# EAGLE schematic memory-slice (EAGLE 7.1.0)
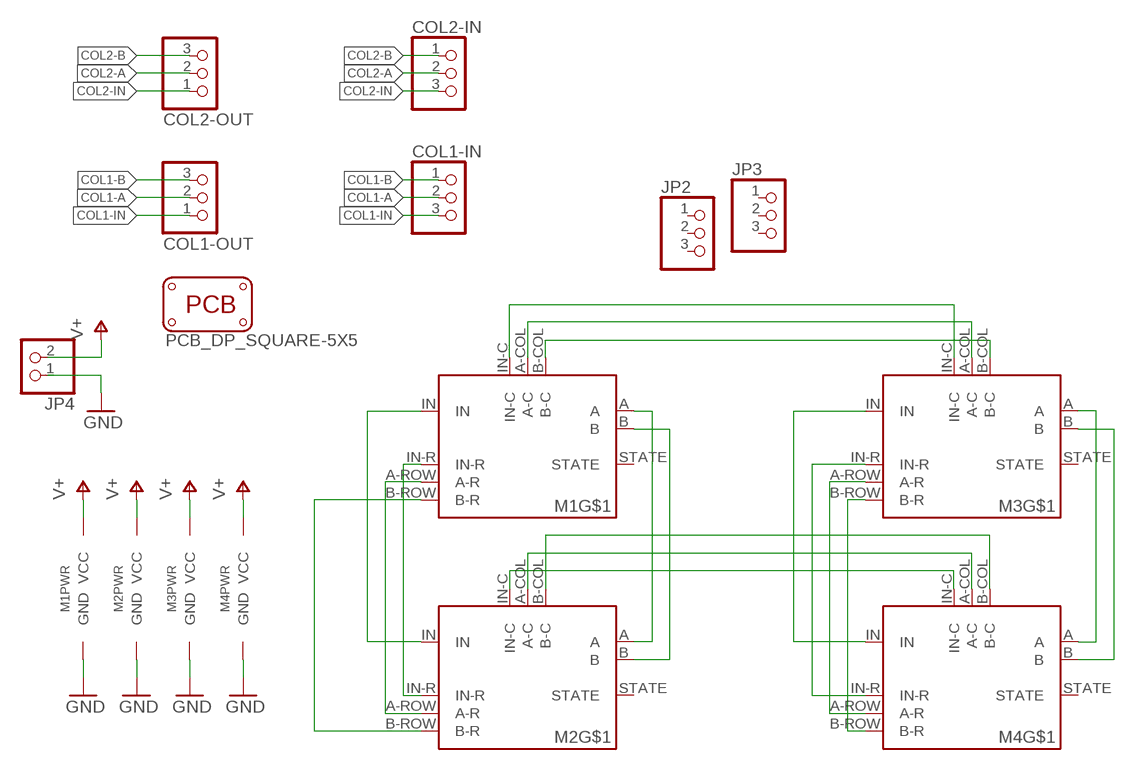
[diagram p0: schematic, sheet 1]

## Parts
COL1-IN  PINHD-1X3/90  [1X03/90]
COL1-OUT  PINHD-1X3/90  [1X03/90]
COL2-IN  PINHD-1X3/90  [1X03/90]
COL2-OUT  PINHD-1X3/90  [1X03/90]
JP2  PINHD-1X3/90  [1X03/90]
JP3  PINHD-1X3/90  [1X03/90]
JP4  PINHD-1X2  [1X02]
M1  MEMORY-1BIT-CELL  [MEMORY-1BIT-CELL]
M2  MEMORY-1BIT-CELL  [MEMORY-1BIT-CELL]
M3  MEMORY-1BIT-CELL  [MEMORY-1BIT-CELL]
M4  MEMORY-1BIT-CELL  [MEMORY-1BIT-CELL]
PCB1  PCB_DP_SQUARE-5X5  [DP5050_V1]

## Nets
COL1-A: COL1-IN.2 COL1-OUT.2 M1.A-COL(A-C) M3.A-COL(A-C)
COL1-B: COL1-IN.1 COL1-OUT.3 M1.B-COL(B-C) M3.B-COL(B-C)
COL1-IN: COL1-IN.3 COL1-OUT.1 M1.IN-C M3.IN-C
COL2-A: COL2-IN.2 COL2-OUT.2 M2.A-COL(A-C) M4.A-COL(A-C)
COL2-B: COL2-IN.1 COL2-OUT.3 M2.B-COL(B-C) M4.B-COL(B-C)
COL2-IN: COL2-IN.3 COL2-OUT.1 M2.IN-C M4.IN-C
GND: JP4.1 M1.GND(PWR:GND) M2.GND(PWR:GND) M3.GND(PWR:GND) M4.GND(PWR:GND)
N$1: M1.IN M2.IN
N$2: M3.IN M4.IN
N$6: M3.B-ROW(B-R) M4.B-ROW(B-R)
N$7: M3.A-ROW(A-R) M4.A-ROW(A-R)
N$8: M3.IN-R M4.IN-R
N$9: M3.A M4.A
N$10: M3.B M4.B
N$11: M1.IN-R M2.IN-R
N$15: M1.A M2.A
N$16: M1.B M2.B
N$17: M1.A-ROW(A-R) M2.A-ROW(A-R)
N$18: M1.B-ROW(B-R) M2.B-ROW(B-R)
V+: JP4.2 M1.VCC(PWR:VCC) M2.VCC(PWR:VCC) M3.VCC(PWR:VCC) M4.VCC(PWR:VCC)
Unconnected: JP2.1 JP2.2 JP2.3 JP3.1 JP3.2 JP3.3 M1.STATE M2.STATE M3.STATE M4.STATE

## Library data of the parts
COL1-IN COL1-OUT COL2-IN COL2-OUT JP2 JP3 = pinhead:PINHD-1X3: PIN HEADER
JP4 = pinhead:PINHD-1X2: PIN HEADER
M1-M4 = p.peter-logic:MEMORY-1BIT-CELL
PCB1 = dp_pcb:PCB_DP_SQUARE: Dangerous Prototypes Standard Square PCB sizes